# EAGLE design sirvo.v3.0 (EAGLE 6.4)
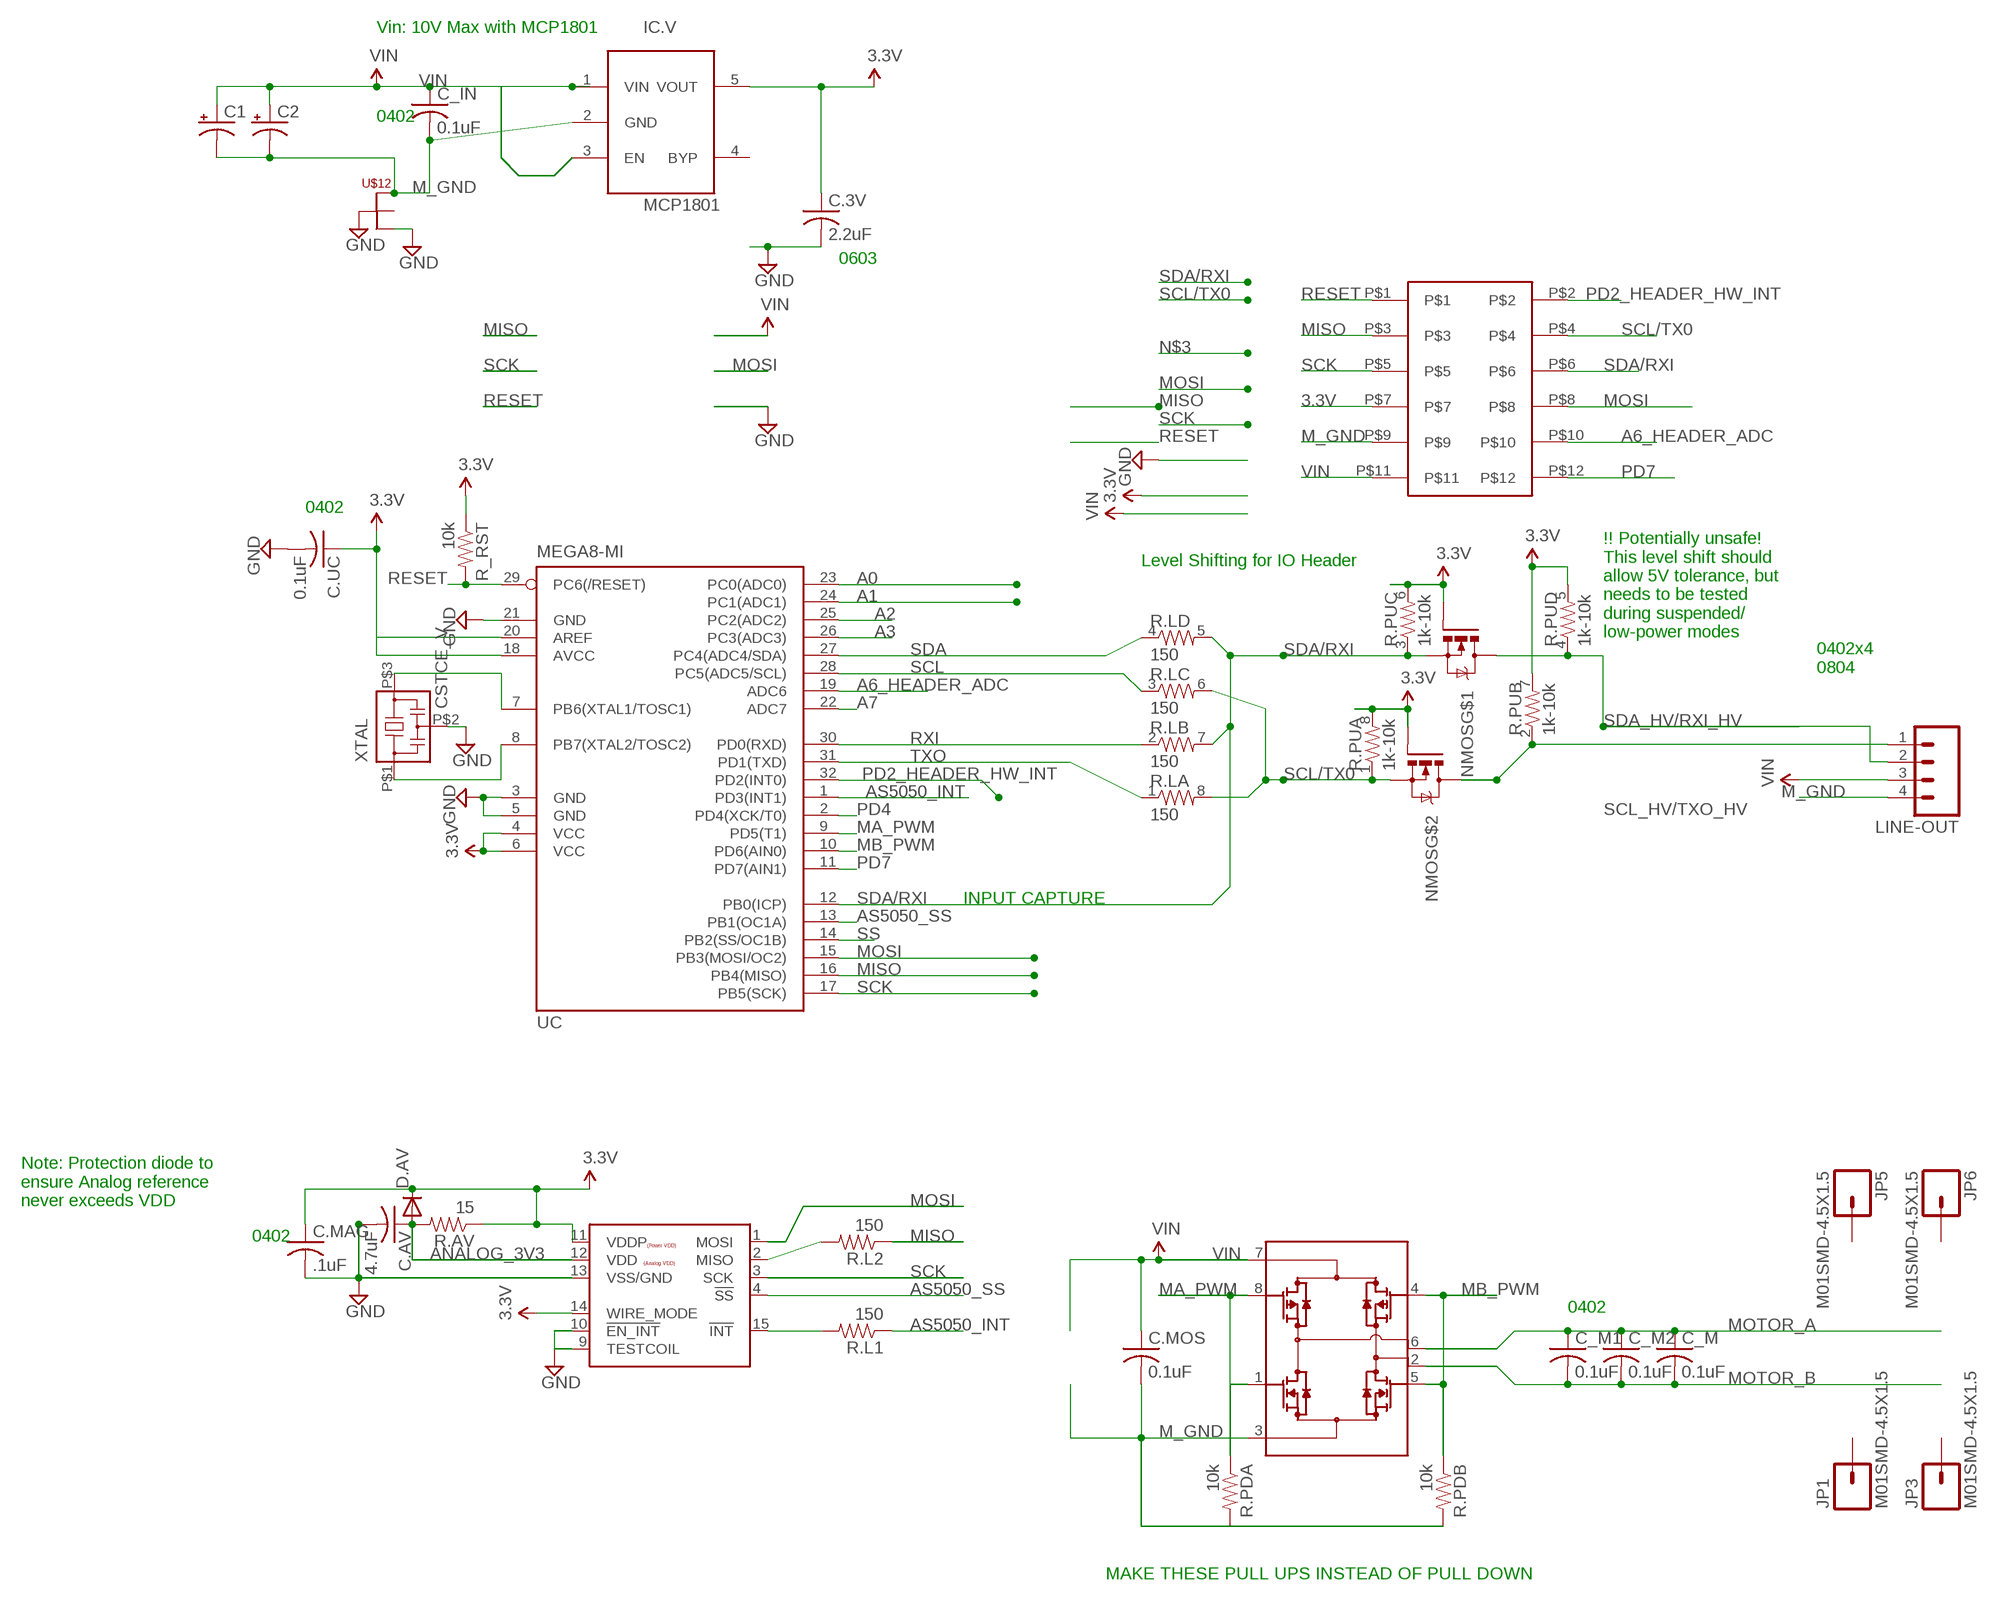
[diagram p0: schematic, sheet 1]

## Parts
<HEADER>  M06X022MM_SMT  [M2X06_SMD]
C1  CAP_POLPTH2  [CPOL-RADIAL-10UF-25V]
C2  CAP_POLC  [PANASONIC_C]
C.3V  2.2uF  C-USC0603  [C0603]
C.AV  4.7uF  C-USC0603  [C0603]
C.MAG  .1uF  C-USC0402  [C0402]
C.MOS  0.1uF  C-USC0402  [C0402]
C.UC  0.1uF  C-USC0402  [C0402]
C_IN  0.1uF  C-USC0402  [C0402]
C_M  0.1uF  C-USC0402  [C0402]
C_M1  0.1uF  C-USC0402  [C0402]
C_M2  0.1uF  C-USC0402  [C0402]
D.AV  DIODESOD  [SOD-323]
IC.V  MCP1801  LDO-REGULATORMCP1801  [SOT23-5L]
JP1  M01SMD-4.5X1.5  [PAD-1.5X4.5]
JP3  M01SMD-4.5X1.5  [PAD-1.5X4.5]
JP5  M01SMD-4.5X1.5  [PAD-1.5X4.5]
JP6  M01SMD-4.5X1.5  [PAD-1.5X4.5]
LINE-OUT  M041X04_NO_SILK  [1X04_NO_SILK]
MAG  AS5050  [QFN16_4X4]
MOS  MOSFET-ARRAYMOSFET-ARRAY-H-BRIDGE  [SO08]
NMOS  MOSFET-ARRAY-PAIR  [SOT-363]
R.AV  15  RESISTOR0402-RES  [0402-RES]
R.L  150  RESISTOR-ARRAY0603-ARV  [0603-ARV]
R.L1  150  RESISTOR0402-RES  [0402-RES]
R.L2  150  RESISTOR0402-RES  [0402-RES]
R.PDA  10k  RESISTOR0402-RES  [0402-RES]
R.PDB  10k  RESISTOR0402-RES  [0402-RES]
R.PU  1k-10k  RESISTOR-ARRAY0603-ARV  [0603-ARV]
R_RST  10k  RESISTOR0402-RES  [0402-RES]
U$12  NET-JUNCTION8-MIL-DIAMETER  [NET-JUNCTION]
UC  MEGA8-MI  [MLF32]
XTAL  CSTCE_V  [CSTCE_V]

## Nets
3.3V: <HEADER>.P$7 C.3V.1 C.MAG.1 C.UC.1 D.AV.1(C) IC.V.5(VOUT) MAG.11(VDDP) MAG.14(WIRE_MODE) NMOS.P$2(G) NMOS.P$5(G) R.AV.1 R.PU.5 R.PU.6 R.PU.7 R.PU.8 R_RST.1 UC.4(VCC) UC.6(VCC) UC.20(AREF)
A0: UC.23(PC0(ADC0))
A1: UC.24(PC1(ADC1))
A2: UC.25(PC2(ADC2))
A3: UC.26(PC3(ADC3))
A6_HEADER_ADC: <HEADER>.P$10 UC.19(ADC6)
A7: UC.22(ADC7)
ANALOG_3V3: C.AV.1 D.AV.2(A) MAG.12(VDD) R.AV.2
AS5050_INT: R.L1.1 UC.1(PD3(INT1))
AS5050_SS: MAG.4(!SS) UC.13(PB1(OC1A))
GND [Ground]: C.3V.2 C.AV.2 C.MAG.2 C.UC.2 MAG.9(TESTCOIL) MAG.10(!EN_INT) MAG.13(VSS/GND) U$12.P$1 U$12.P$4 UC.3(GND) UC.5(GND) UC.21(GND) XTAL.P$2
M_GND: <HEADER>.P$9 C1.2(-) C2.- C.MOS.2 C_IN.2 IC.V.2(GND) LINE-OUT.4 MOS.3(N1S/N2S) R.PDA.2 R.PDB.2 U$12.P$3
MA_PWM: MOS.1(N1G) MOS.8(P1G) R.PDA.1 UC.9(PD5(T1))
MB_PWM: MOS.4(N2G) MOS.5(P2G) R.PDB.1 UC.10(PD6(AIN0))
MISO: <HEADER>.P$3 R.L2.1 UC.16(PB4(MISO))
MOSI: <HEADER>.P$8 MAG.1(MOSI) UC.15(PB3(MOSI/OC2))
MOTOR_A: C_M1.1 C_M2.1 C_M.1 MOS.6(N2D/P2D)
MOTOR_B: C_M1.2 C_M2.2 C_M.2 MOS.2(N1D/P1D)
N$1: UC.7(PB6(XTAL1/TOSC1)) XTAL.P$3
N$2: UC.8(PB7(XTAL2/TOSC2)) XTAL.P$1
N$6: MAG.15(!INT) R.L1.2
N$14: MAG.2(MISO) R.L2.2
N$15: UC.18(AVCC)
PD2_HEADER_HW_INT: <HEADER>.P$2 UC.32(PD2(INT0))
PD4: UC.2(PD4(XCK/T0))
PD7: <HEADER>.P$12 UC.11(PD7(AIN1))
RESET: <HEADER>.P$1 R_RST.2 UC.29(PC6(/RESET))
RXI: R.L.2 UC.30(PD0(RXD))
SCK: <HEADER>.P$5 MAG.3(SCK) UC.17(PB5(SCK))
SCL: R.L.3 UC.28(PC5(ADC5/SCL))
SCL/TX0: <HEADER>.P$4 NMOS.P$1(S) R.L.6 R.L.8 R.PU.1
SCL_HV/TXO_HV: LINE-OUT.1 NMOS.P$6(D) R.PU.2
SDA: R.L.4 UC.27(PC4(ADC4/SDA))
SDA/RXI: <HEADER>.P$6 NMOS.P$4(S) R.L.5 R.L.7 R.PU.3 UC.12(PB0(ICP))
SDA_HV/RXI_HV: LINE-OUT.2 NMOS.P$3(D) R.PU.4
SS: UC.14(PB2(SS/OC1B))
TXO: R.L.1 UC.31(PD1(TXD))
VIN: <HEADER>.P$11 C1.1(+) C2.+ C.MOS.1 C_IN.1 IC.V.1(VIN) IC.V.3(EN) LINE-OUT.3 MOS.7(P1S/P2S)
Unconnected: IC.V.4(BYP) JP1.P$1 JP3.P$1 JP5.P$1 JP6.P$1 U$12.P$5

## Notes on the sheet
- Vin: 10V Max with MCP1801
- 0402
- 0603
- 0402
- Level Shifting for IO Header
- !! Potentially unsafe! 
  This level shift should 
  allow 5V tolerance, but 
  needs to be tested
  during suspended/
  low-power modes
- 0402x4
  0804
- INPUT CAPTURE
- Note: Protection diode to 
  ensure Analog reference
  never exceeds VDD
- 0402
- 0402
- MAKE THESE PULL UPS INSTEAD OF PULL DOWN

## Library data of the parts
<HEADER> = tekdemo:M06X02
C1 C2 = SparkFun-Passives:CAP_POL: Capacitor Polarized These are standard SMD and PTH capacitors. Normally 10uF, 47uF, and 100uF in electrolytic and tantalum varieties. Always verify the external diameter of the through hole cap, it varies with capacity, voltage, and manufacturer. The EIA devices should be standard.
C.3V C.AV C.MAG C.MOS C.UC C_IN C_M C_M1 C_M2 = rcl:C-US: CAPACITOR, American symbol
D.AV = tekdemo:DIODE: Diode These are standard reverse protection diodes and small signal diodes. SMA package can handle up to about 1A. SOD-323 can handle about 200mA. What the SOD-323 package when ordering, there are some mfgs out there that are 5-pin packages.
IC.V = tekdemo:LDO-REGULATOR: Standard LDO Footprint
JP1 JP3 JP5 JP6 = SparkFun-Connectors:M01: Header 1 Standard 1-pin 0.1" header. Use with straight break away headers (SKU : PRT-00116), right angle break away headers (PRT-00553), swiss pins (PRT-00743), machine pins (PRT-00117), and female headers (PRT-00115).
LINE-OUT = SparkFun-Connectors:M04: Header 4 Standard 4-pin 0.1" header. Use with straight break away headers (SKU : PRT-00116), right angle break away headers (PRT-00553), swiss pins (PRT-00743), machine pins (PRT-00117), and female headers (PRT-00115). Molex polarized connector foot print use with SKU : PRT-08231 with associated crimp pins and housings. 1MM SMD Version SKU: PRT-10208
MAG = tekdemo:AS5050
MOS = tekdemo:MOSFET-ARRAY
NMOS = tekdemo:MOSFET-ARRAY-PAIR
R.AV R.L1 R.L2 R.PDA R.PDB R_RST = SparkFun-Passives:RESISTOR: Resistor Basic schematic elements and footprints for 0603, 1206, and PTH resistors.
R.L R.PU = SparkFun-Passives:RESISTOR-ARRAY: Array Chip Resistor Source: RS Component / Phycomp
U$12 = tekdemo:NET-JUNCTION
UC = atmel:MEGA8: MICROCONTROLLER 8 Kbytes FLASH, 1 kbytes SRAM, 512 bytes EEPROM, USART, 6-channel 10 bit ADC, 2-channel 8 bit ADC Pin compatible with Atmega48, ATMega88, ATMega168 Source: avr.lbr; MPN: ATMEGA88PA-MU; OC_FARNELL: 1715491; OC_NEWARK: 15R0272
XTAL = tekdemo:CSTCE_V

## Net classes
1 Ground: width 0.127 mm, clearance 0.152 mm
2 High Power: width 0.508 mm, drill 0.508 mm, clearance 0.254 mm
3 Signal: width 0.152 mm

## Board
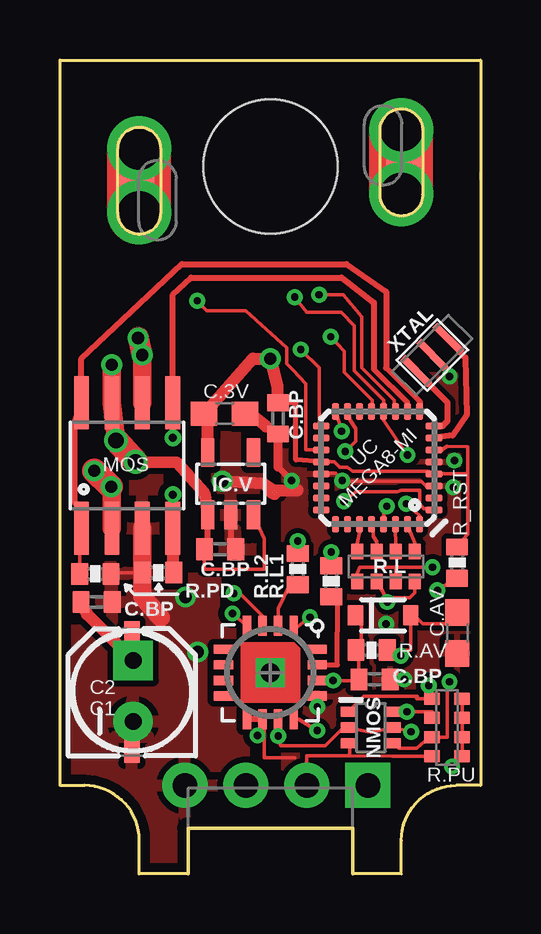
[diagram p1: board, top side]
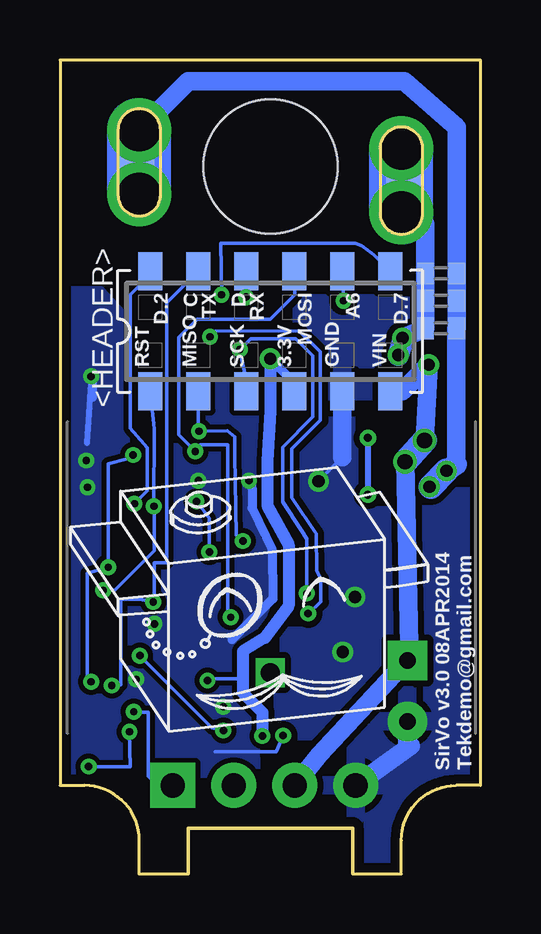
[diagram p2: board, bottom side, seen from below]

Size 17.53 x 33.91 mm. Coordinates in mm from the lower left corner, seen from the top.
Outline: 12.19,0 12.19,1.9 5.33,1.9 5.33,0
Outline: 2.41,27.53 2.41,30.23 arc-180 4.19,30.23 4.19,27.53 arc-180 2.41,27.53
Outline: 13.33,28.3 13.33,30.99 arc-180 15.11,30.99 15.11,28.3 arc-180 13.33,28.3
Copper layers (1*16): Top 0.0356mm / dielectric 1.5011mm / Bottom 0.0356mm
Design rules "LaenPCBOrder *": minimum track width 6mil, minimum drill 12mil, track to track 6mil, track to pad 6mil, pad to pad 6mil, via to via 6mil, smd to smd 6mil, copper to edge 15mil, drill to drill 6mil, minimum pad ring 7mil, minimum via ring 7mil, stop-mask expansion 2mil, vias tented up to drill 30mil, thermal gap 10mil
tKeepout: area 0,20.3 to 17.5,33.9

### Footprints (pad centres in the part's own frame; a part is rotated, then mirrored left to right if it is on the bottom)
M2X06_SMD = smd 1 x 1.6: P$1 -5,-2.5; P$2 -5,2.5; P$3 -3,-2.5; P$4 -3,2.5; P$5 -1,-2.5; P$6 -1,2.5; P$7 1,-2.5; P$8 1,2.5; P$9 3,-2.5; P$10 3,2.5; P$11 5,-2.5; P$12 5,2.5
CPOL-RADIAL-10UF-25V = drill 0.7 pad 1.651 square: 1 1.27,0 | drill 0.7 pad 1.651: 2 -1.27,0
PANASONIC_C = smd 2.2 x 0.65: + 1.9,-0.2; - -1.8,-0.2
C0603 = smd 1.1 x 1: 1 -0.85,0; 2 0.85,0
C0402 = smd 0.7 x 0.9: 1 -0.65,0; 2 0.65,0
SOD-323 = smd 0.63 x 0.83: 1 -1.15,0; 2 1.15,0
SOT23-5L = smd 0.55 x 1.2: 1 -0.95,-1.3; 2 0,-1.3; 3 0.95,-1.3; 4 0.95,1.3; 5 -0.95,1.3
PAD-1.5X4.5 = smd 1.5 x 2: P$1 0,0
1X04_NO_SILK = drill 1.016 pad 1.88 square: 1 0,0 | drill 1.016 pad 1.88: 2 2.54,0; 3 5.08,0; 4 7.62,0
QFN16_4X4 = smd 0.8 x 0.35: 1 -1.95,0.975; 2 -1.95,0.325; 3 -1.95,-0.325; 4 -1.95,-0.975; 9 1.95,-0.975; 10 1.95,-0.325; 11 1.95,0.325; 12 1.95,0.975 | smd 0.35 x 0.8: 5 -0.975,-1.95; 6 -0.325,-1.95; 7 0.325,-1.95; 8 0.975,-1.95; 13 0.975,1.95; 14 0.325,1.95; 15 -0.325,1.95; 16 -0.975,1.95 | drill 0.8 square: P$1 0,0
SO08 = smd 0.61 x 2.21: 1 -1.905,-2.616; 2 -0.635,-2.616; 3 0.635,-2.616; 4 1.905,-2.616; 5 1.905,2.616; 6 0.635,2.616; 7 -0.635,2.616; 8 -1.905,2.616
SOT-363 = smd 0.42 x 0.6: P$1 -0.65,-0.95; P$2 0,-0.95; P$3 0.65,-0.95; P$4 0.65,0.95; P$5 0,0.95; P$6 -0.65,0.95
0402-RES = smd 0.7 x 0.9: 1 -0.65,0; 2 0.65,0
0603-ARV = smd 0.5 x 0.65: 1 -1.2,-0.625; 2 -0.4,-0.625; 3 0.4,-0.625; 4 1.2,-0.625; 5 1.2,0.625; 6 0.4,0.625; 7 -0.4,0.625; 8 -1.2,0.625
SERVO-OUTLINE = hole 5.588: 8.763,29.464
NET-JUNCTION = smd 0.051 x 0.051: P$1 -0.076,0; P$3 0,0.076; P$4 0.076,0; P$5 0,-0.076
MLF32 = smd 0.7 x 0.3: 1 -2.35,1.75; 2 -2.35,1.25; 3 -2.35,0.75; 4 -2.35,0.25; 5 -2.35,-0.25; 6 -2.35,-0.75; 7 -2.35,-1.25; 8 -2.35,-1.75; 17 2.35,-1.75; 18 2.35,-1.25; 19 2.35,-0.75; 20 2.35,-0.25; 21 2.35,0.25; 22 2.35,0.75; 23 2.35,1.25; 24 2.35,1.75 | smd 0.3 x 0.7: 9 -1.75,-2.35; 10 -1.25,-2.35; 11 -0.75,-2.35; 12 -0.25,-2.35; 13 0.25,-2.35; 14 0.75,-2.35; 15 1.25,-2.35; 16 1.75,-2.35; 25 1.75,2.35; 26 1.25,2.35; 27 0.75,2.35; 28 0.25,2.35; 29 -0.25,2.35; 30 -0.75,2.35; 31 -1.25,2.35; 32 -1.75,2.35
CSTCE_V = smd 0.3 x 1.6: P$1 -0.95,0; P$2 0,0; P$3 0.95,0

### Placement (x,y rotation side)
<HEADER>  8.76,22.61 0 bottom
C1  3.05,7.62 90 top
C2  2.79,7.52 90 top
C.3V  6.86,19.18 0 top
C.AV  16.56,10.03 270 top
C.MAG  13.11,8.1 0 top
C.MOS  1.52,11.33 0 top
C.UC  9.08,18.97 270 top
C_IN  6.67,13.53 0 top
C_M  1.65,22.73 0 bottom
C_M1  1.65,25.02 0 bottom
C_M2  1.65,23.88 0 bottom
D.AV  13.46,10.77 0 top
IC.V  7.11,16.26 0 top
JP1  3.18,28.96 0 bottom
JP3  3.18,28.7 0 top
JP5  14.35,29.72 0 bottom
JP6  14.35,29.72 0 top
LINE-OUT  12.83,3.68 180 top
MAG  8.76,8.38 270 top
MOS  2.79,17.02 0 top
NMOS  12.95,6.1 270 top
R.AV  12.98,9.32 0 top
R.L  13.59,12.8 180 top
R.L1  11.3,12.19 270 top
R.L2  9.91,12.7 270 top
R.PDA  1.47,12.5 0 top
R.PDB  4.09,12.55 180 top
R.PU  16.13,6.1 270 top
R_RST  16.55,12.97 270 top
U$1  [LOGO-SIRVO-GOLD]  17.22,5.84 0 bottom
U$3  [SERVO-OUTLINE]  0,0 0 top
U$12  8.94,15.9 270 top
UC  13.23,16.92 180 top
XTAL  15.51,21.62 45 top

### Tracks (layer width: path | path; a pad name or v marks a point on that pad's centre or on a via)
3.3V  (via drill 0.3, 0.51)
  Top 0.152: 10.97,8.05 MAG.14 v11.38,8.05 12.46,8.05 C.MAG.1 12.46,9.32 R.AV.1 12.57,9.4 12.53,10.77 D.AV.1 | 9.14,5.71 v9.09,5.74 9.2,5.33 11.05,5.33 11.81,6.1 NMOS.P$2 12.95,5.89 NMOS.P$5 v14.63,5.92 | R.PU.8 R.PU.7 | 16.64,5.7 R.PU.6 | 16.89,6.5 R.PU.7 | v16.33,4.47 16.64,4.9 R.PU.5 R.PU.6 | R.PU.6 R.PU.7 | 16.99,16.66 16.99,14.15 16.55,13.68 R_RST.1 | UC.20 10.91,17.17 11.43,17.17 11.66,16.94 11.96,16.94 12.19,16.76 15.32,16.76 UC.4 15.69,16.66 16.99,16.66 | 16.99,16.66 16.99,17.79 16.13,17.8 15.91,17.67 UC.6
  Top 0.203: 9.14,5.71 9.14,6.43 | UC.20 9.83,17.25 9.83,19.61 C.UC.1
  Top 0.254: 9.14,6.43 MAG.11
  Top 0.508: IC.V.5 6.16,18.7 C.3V.1 8.04,21.46 v8.76,21.46 9.06,20.31 C.UC.1
  Bottom 0.152: 9.88,8.51 9.88,8.48 9.91,8.38 | 9.91,9.27 9.91,8.48 | v11.38,8.05 11.2,8.13 9.91,8.13 | v14.63,5.92 14.61,4.47 v16.33,4.47 | 9.02,17.17 8.92,17.17 8.89,17.2
  Bottom 0.381: <HEADER>.P$7 7.76,20.46 v8.76,21.46
  Bottom 0.508: v8.76,21.46 arc26 8.76,21.08 8.76,19.3 8.89,17.2 8.89,15.34 8,13.72 8,11.18 8.99,9.83 9.91,9.27 9.91,8.38 9.91,8.13 9.91,7.54 9.09,6.73 v9.09,5.74
A6_HEADER_ADC  (via drill 0.3)
  Top 0.152: UC.19 10.87,17.68 10.24,17.68 10.24,20.42 9.73,20.98 9.45,21.26 9.45,21.92 7.75,23.47 6.12,23.47 v5.71,23.88
  Bottom 0.152: v5.71,23.88 5.71,25.06 arc-90 <HEADER>.P$10
ANALOG_3V3  (via drill 0.3)
  Top 0.152: C.AV.1 16.09,10.41 15.11,10.41 14.76,10.77 D.AV.2 14.61,9.32 R.AV.2 13.61,9.09 v14.2,9.09 | v10.72,5.97 9.95,6.43 MAG.12
  Bottom 0.152: v14.2,9.09 11.2,6.1 v10.72,5.97
AS5050_INT  (via drill 0.3)
  Top 0.152: R.L1.1 v11.3,13.41 | v11.84,15.52 12.32,15.93 14.05,15.93 14.22,15.98 14.99,15.98 14.99,15.42 15.16,15.21 15.54,15.21 UC.1
  Bottom 0.152: v11.3,13.41 11.3,14.81 v11.84,15.52
AS5050_SS  (via drill 0.3)
  Top 0.152: MAG.4 v7.19,10.85 | UC.13 13.01,19.73 11.84,20.9 11.84,21.77 v11.28,22.38
  Bottom 0.152: v7.19,10.85 6.65,11.33 6.65,12.29 6.83,12.62 6.86,14.17 7.87,15.67 7.87,17.7 6.68,18.9 6.68,21.74 7.57,22.63 11.05,22.61 v11.28,22.38
GND  (via drill 0.3)
  Top 0.152: MAG.10 8.51,6.36 8.51,6.35 | MAG.13 v10.72,6.96 | 8.51,6.35 8.51,4.83 9.78,4.83 | 8.51,6.35 v8.23,5.77 | C.3V.2 8.09,19.05 | UC.21 10.95,16.69 11.48,16.69 11.74,16.36 15.06,16.36 15.27,16.15 15.57,16.15 | U$12.P$4 U$12.P$1
  Top 0.254: MAG.10 MAG.9 | XTAL.P$2 16.23,20.9 v16.23,20.73 | v9.65,16.38 9.09,16.94 | 9.09,18.09 C.UC.2
  Top 0.381: 9.09,16.94 9.09,18.09 | 8.58,18.64 C.UC.2
  Top 0.508: U$12.P$4 8.84,15.88 | U$12.P$1 9.91,15.98 9.91,16 | 8.09,19.05 8.58,18.64
  Bottom 0.152: 10.74,6.86 10.79,6.86 | v8.23,5.77 8.51,5.08 11.05,5.08
  Bottom 0.254: 16.13,19.81 16.13,20.62 v16.23,20.73 16.41,17.96
  Bottom 0.381: v9.65,16.38 9.53,16.08 9.53,15.24 8.69,13.51 8.66,11.46 10.36,9.75
  other vias: 16.43,17.22 14.35,8.1 13.59,10.41 16.38,16.1 11.76,16.38
  pour Bottom (isolate 0.203): 9.27,20.57 12.32,20.57 15.8,24.36 17.02,24.36 17.02,3.94 9.27,4.19 9.53,9.4 8.76,11.43 8.76,13.46 9.27,13.97
  pour Top (isolate 0.203): 9.27,20.83 17.27,20.83 17.27,4.19 9.27,4.19
M_GND  (via drill 0.51)
  Top 0.152: 3.14,12.04 3.43,12.04 3.44,12.04 R.PDB.2 2.12,12.55 R.PDA.2 | C2.- C1.2
  Top 0.254: IC.V.2 7.11,13.73 C_IN.2
  Top 0.508: v6.76,16.36 8.48,16.26 U$12.P$3
  Top 0.762: MOS.3 3.43,12.04 3.43,11.56 4.19,10.67
  Bottom 0.152: 5.76,17.35 v6.76,16.36
  Bottom 0.762: 2.99,6.07 2.99,6.55 C1.2 3.05,5.46 2.92,5.33 LINE-OUT.4 | <HEADER>.P$9 5.76,17.35
  other vias: 5.23,11.53 5.74,9.25
  pour Bottom (isolate 0.254, rank 6): 0.64,0 0.64,35.56 17.14,35.56 17.14,0
  pour Top (isolate 0.254, rank 6): 0.64,0 0.64,35.56 17.14,35.56 17.14,3.81 13.33,0
MA_PWM
  Top 0.152: R.PDA.1 0.82,14.4 MOS.1
  Top 0.203: 13.59,21.08 14.98,19.69
  Top 0.254: MOS.1 0.89,15.14 0.58,15.49 0.58,18.77 MOS.8 0.89,21.46 5.08,25.4 11.94,25.4 13.59,24.26 13.59,21.08 | 14.98,19.69 UC.9
MB_PWM  (via drill 0.33)
  Top 0.152: 4.7,12.55 R.PDB.1 | 14.48,19.63 UC.10
  Top 0.203: 13.08,21.03 14.48,19.63
  Top 0.254: MOS.5 v4.7,18.16 4.7,24.13 5.46,24.84 11.74,24.84 13.08,23.8 13.08,21.03 | v4.7,15.8 MOS.4
  Top 0.508: MOS.4 4.7,12.55
  Bottom 0.254: v4.7,18.16 v4.7,15.8
MISO  (via drill 0.3)
  Top 0.152: R.L2.1 v9.91,13.87 | v11.74,18.44 UC.16
  Bottom 0.152: v9.91,13.87 10.18,14.1 10.24,17.45 10.24,18.21 10.57,18.47 v11.74,18.44 11.76,18.47 <HEADER>.P$3
MOSI  (via drill 0.3)
  Top 0.152: 9.74,10.16 v10.41,10.69 | v11.89,17.6 12.32,18.03 12.32,18.54 12.09,18.9 UC.15
  Top 0.254: MAG.1 9.74,10.16
  Bottom 0.152: v10.41,10.69 10.54,10.82 10.54,17.88 11.68,17.88 v11.89,17.6 12.57,18.29 12.57,22.35 11.81,23.11 8.76,23.11 7.75,24.13 <HEADER>.P$8
MOTOR_A  (via drill 0.51)
  Top 0.762: MOS.6 v3.43,21.62
  Top 0.889: v3.43,21.62 v3.25,22.33
  Bottom 0.762: v3.25,22.33 2.68,22.55 C_M.1 C_M2.1 C_M1.1 2.3,27.07 3.18,27.69
  Bottom 0.889: v3.43,21.62 3.23,22.25
MOTOR_B  (via drill 0.51, 1.78)
  Top 0.762: MOS.2 2.16,15.67 v2.13,16.13
  Top 1.016: 2.11,16.13 v1.42,16.79
  Top 2.667: v14.22,28.32 v14.22,30.99
  Bottom 0.152: 12.07,33.02 12.19,33.02
  Bottom 0.762: 1.02,17.07 1.02,22.72 C_M.2 C_M2.2 C_M1.2 1,31.1 3.18,33.02 12.07,33.02 | v2.13,16.13 2.08,16.13 | 12.19,33.02 v14.22,30.99
  Bottom 0.889: v1.42,16.79 1.02,17.07
  Bottom 1.016: 2.08,16.13 v1.42,16.79
  Bottom 2.667: v14.22,28.32 v14.22,30.99
N$1
  Top 0.254: XTAL.P$3 16.89,21.51 16.94,19.13 16.36,18.27 UC.7
N$2
  Top 0.254: UC.8 15.95,18.67 16.15,18.87 16.15,19.63 XTAL.P$1
N$4  (via drill 1.78)
  Top 2.667: v3.3,27.56 v3.3,30.23
  Bottom 2.667: v3.3,27.56 v3.3,30.23
N$6
  Top 0.203: MAG.15 11.56,8.71 11.58,11.43 R.L1.2
N$14
  Top 0.152: MAG.2 9.09,11.05 9.58,12.05 R.L2.2
PD2_HEADER_HW_INT  (via drill 0.3)
  Top 0.152: UC.32 14.98,14.91 v14.43,15.42
  Bottom 0.152: v14.43,15.42 13.89,15.95 13.89,17.75 14.61,18.57 14.61,24.13 13.84,24.89 <HEADER>.P$2
PD7  (via drill 0.3)
  Top 0.152: UC.11 13.92,19.33 13.92,19.74 12.57,21.08 12.57,23.22 11.81,24.13 v10.79,24.13
  Bottom 0.152: v10.79,24.13 10.82,26.26 5.23,26.26 4.95,26.16 4.45,25.79 <HEADER>.P$12
RESET  (via drill 0.3)
  Top 0.152: UC.29 13.49,15.08 v13.61,15.32 | R_RST.2 v15.72,11.81
  Bottom 0.152: v15.72,11.81 15.24,11.81 13.59,13.46 13.59,15.24 13.51,15.32 v13.61,15.32 13.59,18.54 <HEADER>.P$1
RXI
  Top 0.152: UC.30 13.97,14.58 13.97,14.35 13.99,13.75 R.L.2
SCK  (via drill 0.3)
  Top 0.152: MAG.3 8.44,10.74 7.49,11.68 v7.24,11.68 | UC.17 10.79,18.75 10.79,21.08 v10.03,21.84
  Bottom 0.152: v7.24,11.68 7.24,13.97 8.25,15.49 8.25,17.78 6.99,19.05 6.99,21.59 7.7,22.3 9.58,22.3 v10.03,21.84 9.76,20.56 <HEADER>.P$5
SCL
  Top 0.152: UC.28 13.06,14.6 13.06,14.07 13.19,13.84 R.L.3
SCL/TX0  (via drill 0.3)
  Top 0.152: NMOS.P$1 12.65,7.39 14.88,7.39 14.86,7.3 R.PU.1 15.37,7.3 v15.37,7.85 | R.L.6 13.44,11.77 v13.64,11.33 13.82,11.51 14.58,11.51 14.79,11.72 R.L.8
  Bottom 0.152: v15.37,7.85 14.99,7.87 14.99,11.43 14.22,11.43 v13.64,11.33 13.59,11.33 13.59,12.95 13.08,12.95 13.08,23.79 <HEADER>.P$4
SCL_HV/TXO_HV  (via drill 0.3)
  Top 0.152: NMOS.P$6 v14.45,6.76 15.5,6.76 R.PU.2
  Bottom 0.152: LINE-OUT.1 13.46,3.68 13.84,4.06 13.84,6.73 14.25,6.73 v14.45,6.76
SDA
  Top 0.152: UC.27 12.5,14.6 12.5,14.28 12.39,13.77 R.L.4
SDA/RXI  (via drill 0.3)
  Top 0.152: NMOS.P$4 14.12,5.23 14.86,5.23 15.2,5.52 R.PU.3 16.13,5.7 16.13,7.9 v16.23,8 | R.L.5 12.39,12.52 12.5,12.78 14,12.78 | 14,12.78 R.L.7 | 14,12.78 v15.52,12.78 | v14.48,17.45 13.51,18.85 13.48,18.88 UC.12 13.49,19.74 12.27,20.96 12.27,22.84 11.71,23.39 10.29,23.39 v9.78,24.03
  Bottom 0.152: v16.23,8 16.38,8.03 16.38,12.52 v15.52,12.78 15.52,17.09 14.71,17.3 14.55,17.37 v14.48,17.45 | v9.78,24.03 9.78,25.09 <HEADER>.P$6
SDA_HV/RXI_HV
  Top 0.152: 10.29,3.98 LINE-OUT.2 10.29,4.93 12.06,4.91 | 12.06,4.91 13.84,4.9 R.PU.4 | NMOS.P$3 12.06,5.39 12.06,4.91
TXO
  Top 0.152: 14.5,14.62 UC.31 14.58,14.24 14.79,13.79 R.L.1
VIN  (via drill 0.51, 0.64)
  Top 0.152: IC.V.3 8.51,13.97 8.51,12.7 6.02,12.7 C_IN.1 | C2.+ C1.1
  Top 0.254: C_IN.1 6.16,13.68 IC.V.1
  Top 0.508: C.MOS.1 1.13,10.81 C1.1 | v3.15,17.17 4.86,17.14 6,15.88 IC.V.1
  Top 0.762: v2.16,21.21 MOS.7 v2.34,18.06
  Top 1.016: v3.15,17.17 v2.34,18.06
  Bottom 0.152: <HEADER>.P$11 3.26,20.11
  Bottom 0.762: v3.15,17.17 2.97,9.53 C1.1 6.73,4.95 LINE-OUT.3 | v2.34,18.06 v2.16,21.21 3.26,20.11
  Bottom 1.016: v3.15,17.17 v2.34,18.06

### Text on the board
bPlace: D.2 / TX / RX / MOSI / A6 / D.7 | C / D | RST / MISO / SCK / 3.3V / GND / VIN | SirVo v3.0 08APR2014 / Tekdemo@gmail.com
tNames: C.BP | C.BP | R.PD | C.BP | C.BP
tDocu: MOVE MOTOR CAPS, / THEY INTERFERE WITH SERVO LID | Optional LEDs / over here? | DIODE